# EAGLE design Videre (EAGLE 6.4)

## Sheet 1 of 4
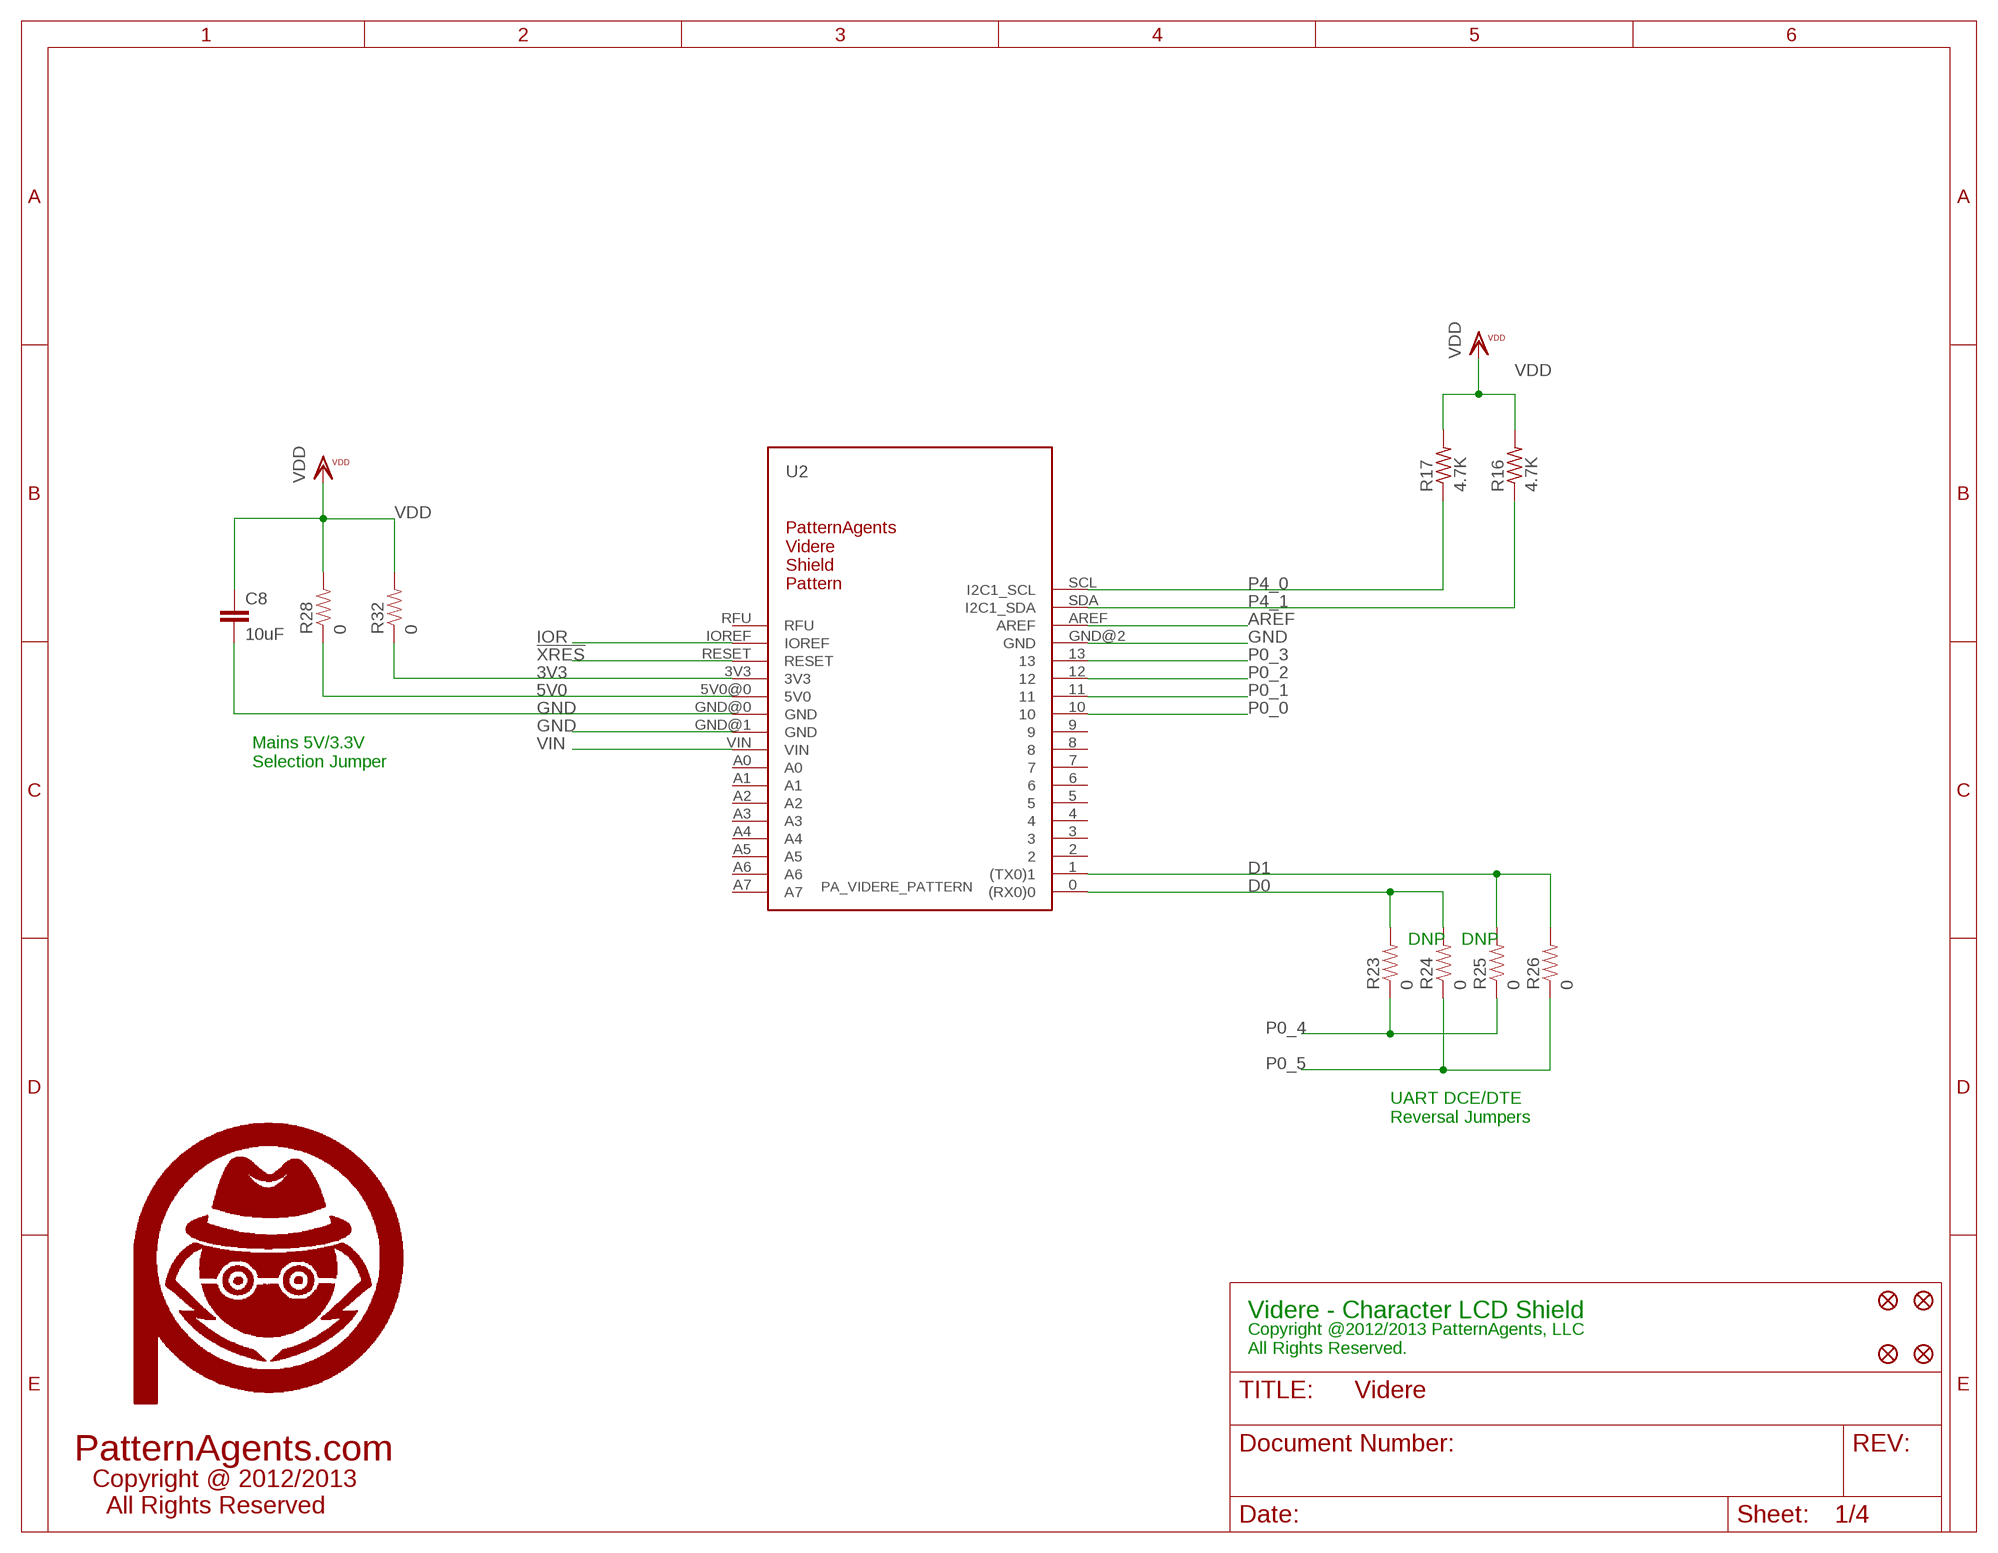
[diagram p0: schematic, sheet 1]

### Parts
C8  10uF  CAP1210  [1210]
FID1  FIDUCIAL1.5X3  [FIDUCIAL-1.5X3]
FID2  FIDUCIAL1.5X3  [FIDUCIAL-1.5X3]
FID3  FIDUCIAL1.5X3  [FIDUCIAL-1.5X3]
FID4  FIDUCIAL1.5X3  [FIDUCIAL-1.5X3]
R16  4.7K  RESISTORR0603  [R0603]
R17  4.7K  RESISTORR0603  [R0603]
R23  0  RESISTOR_SFE0603-RES  [0603-RES]
R24  0  RESISTOR_SFE0603-RES  [0603-RES]
R25  0  RESISTOR_SFE0603-RES  [0603-RES]
R26  0  RESISTOR_SFE0603-RES  [0603-RES]
R28  0  RESISTOR_SFE0603-RES  [0603-RES@1]
R32  0  RESISTOR_SFE0603-RES  [0603-RES@1]
U2  PA_VIDERE_PATTERN  [PA_VIDERE_PATTERN]
U$3  PA_LOGO_SYMLARGE  [PA_LOGO_AGENT_LRG_SYM]

### Nets
3V3: R32.1 U2.3V3
5V0: R28.1 U2.5V0@0(5V0)
!XRES: U2.RESET ; also sheet 2
AREF: U2.AREF
D0: R23.2 R24.2 U2.0((RX0)0)
D1: R25.2 R26.2 U2.1((TX0)1)
GND: C8.2 U2.GND@0(GND) U2.GND@1(GND) U2.GND@2(GND) ; also sheet 2,3,4
IOR: U2.IOREF
P0_0: U2.10 ; also sheet 2
P0_1: U2.11 ; also sheet 2
P0_2: U2.12 ; also sheet 2
P0_3: U2.13 ; also sheet 2
P0_4: R23.1 R25.1 ; also sheet 2
P0_5: R24.1 R26.1 ; also sheet 2
P4_0: R17.1 U2.SCL(I2C1_SCL) ; also sheet 2
P4_1: R16.1 U2.SDA(I2C1_SDA) ; also sheet 2
VDD: C8.1 R16.2 R17.2 R28.2 R32.2 ; also sheet 2,3,4
VIN: U2.VIN ; also sheet 4
Unconnected: U2.2 U2.3 U2.4 U2.5 U2.6 U2.7 U2.8 U2.9 U2.A0 U2.A1 U2.A2 U2.A3 U2.A4 U2.A5 U2.A6 U2.A7

### Notes on the sheet
- Mains 5V/3.3V
  Selection Jumper
- DNP | DNP
- UART DCE/DTE
  Reversal Jumpers
- Videre - Character LCD Shield
- Copyright @2012/2013 PatternAgents, LLC
  All Rights Reserved.
- PatternAgents.com
- Copyright @ 2012/2013
    All Rights Reserved

## Sheet 2 of 4
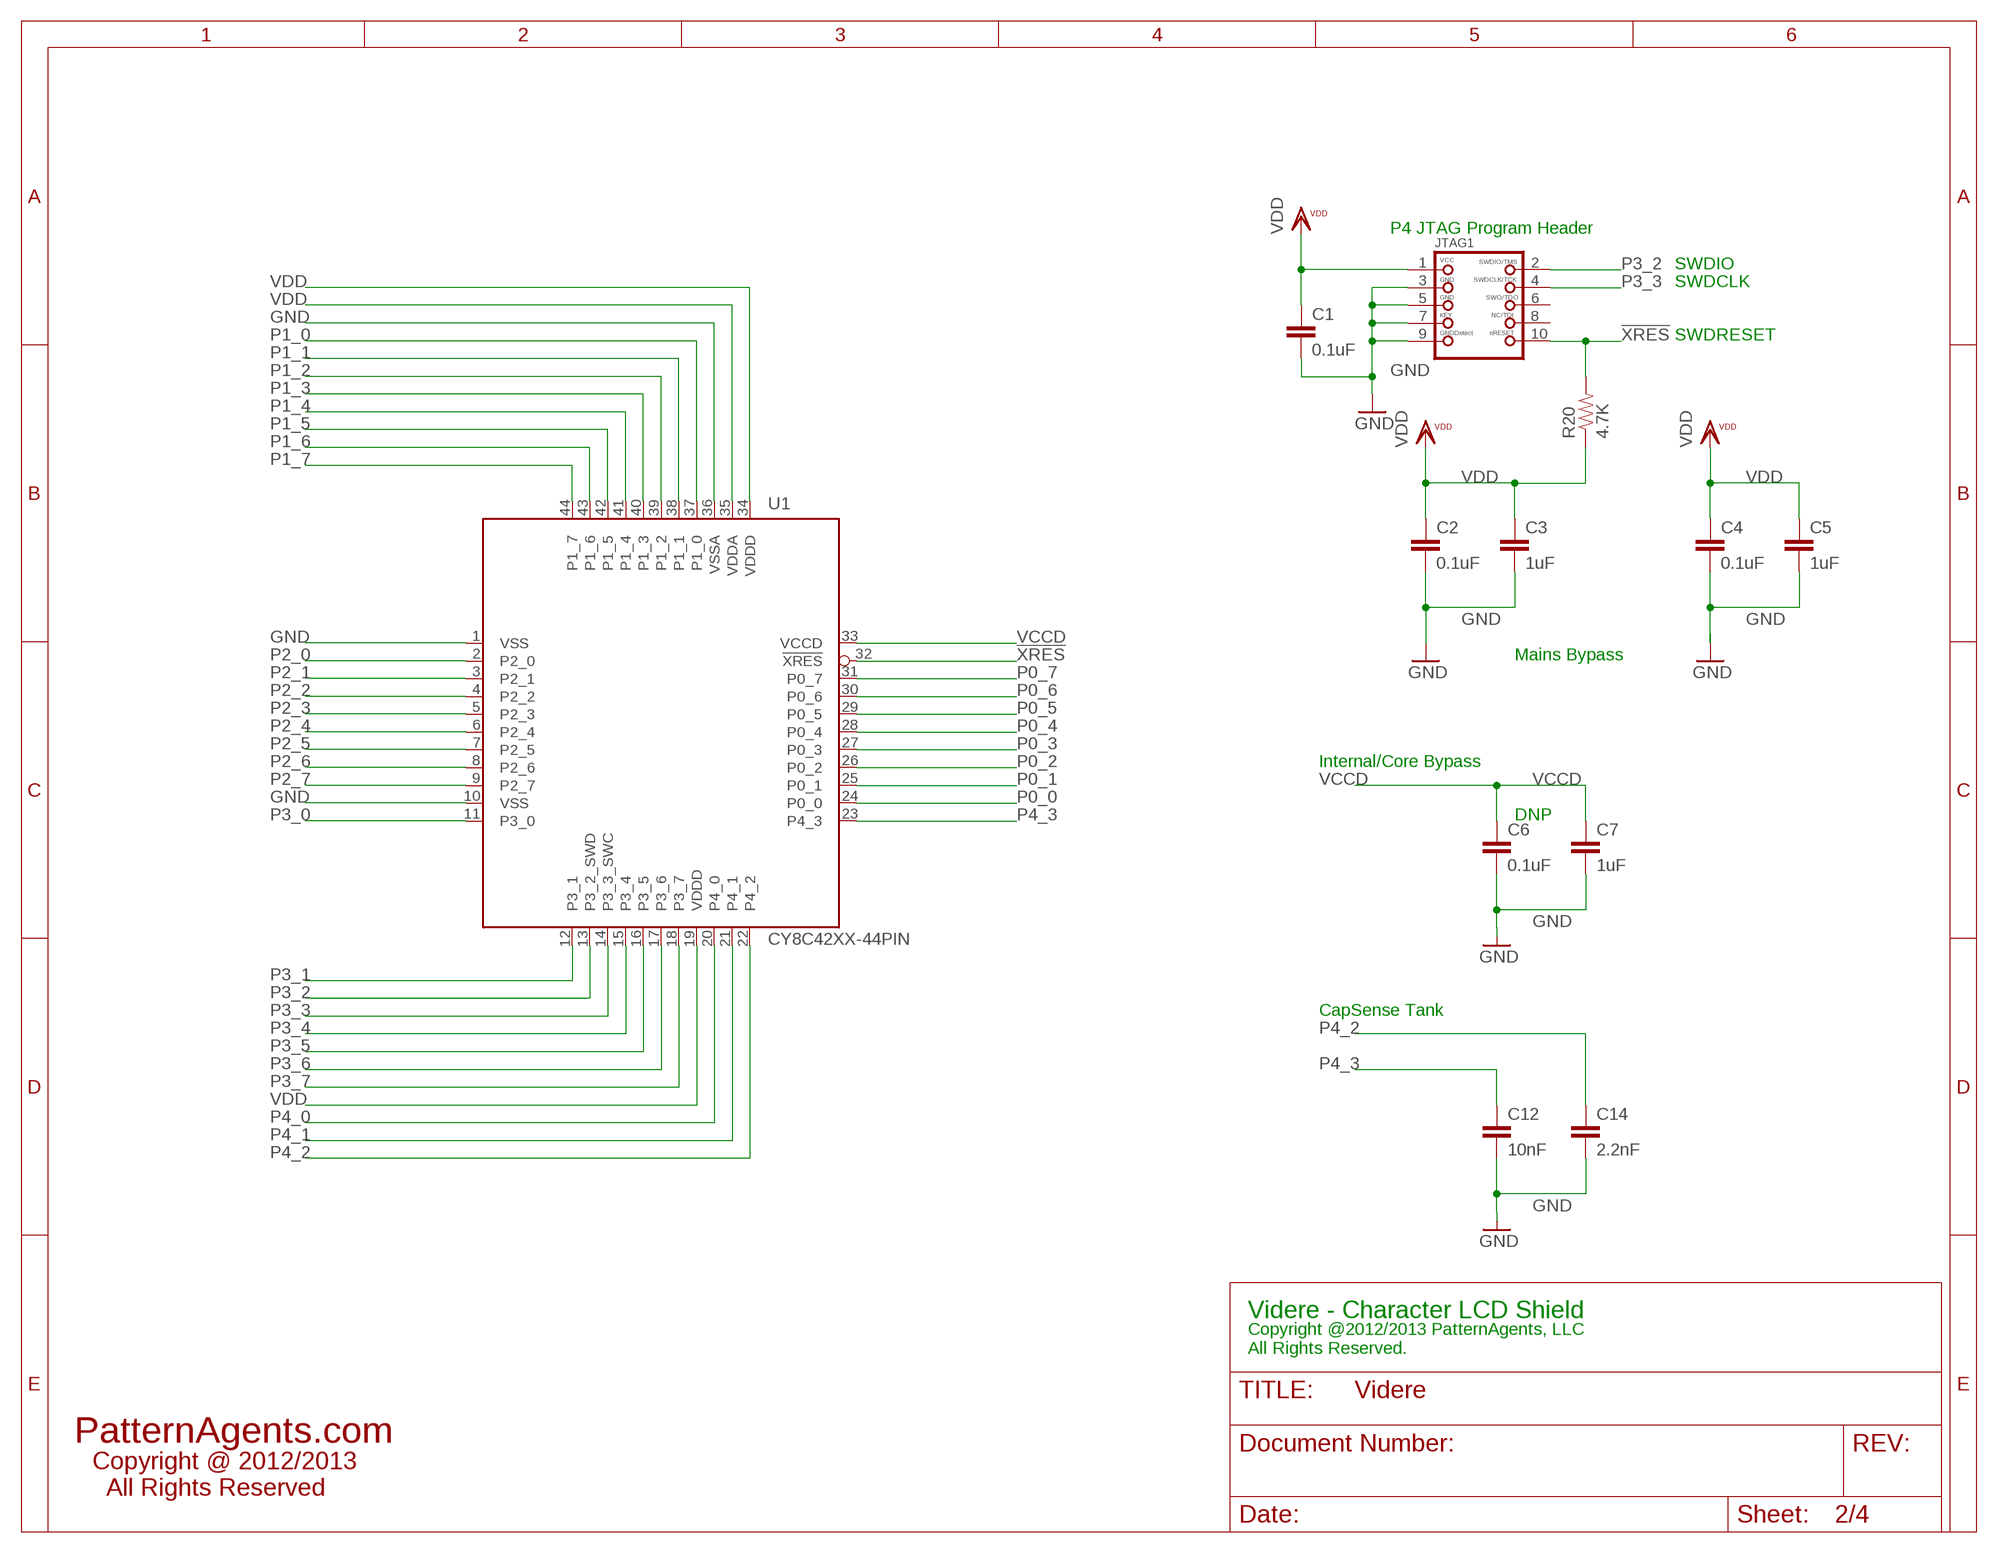
[diagram p1: schematic, sheet 2]

### Parts
C1  0.1uF  CAP0603-CAP  [0603-CAP]
C2  0.1uF  CAP0603-CAP  [0603-CAP]
C3  1uF  CAP0603-CAP  [0603-CAP]
C4  0.1uF  CAP0603-CAP  [0603-CAP]
C5  1uF  CAP0603-CAP  [0603-CAP]
C6  0.1uF  CAP0603-CAP  [0603-CAP]
C7  1uF  CAP0603-CAP  [0603-CAP]
C12  10nF  CAP0603-CAP  [0603-CAP]
C14  2.2nF  CAP0603-CAP  [0603-CAP]
JTAG1  JTAG-CORTEXM3  [2X05_1.27MM_SMT]
R20  4.7K  RESISTOR_SFE0603-RES  [0603-RES]
U1  CY8C42XX-44PIN  [TQFP-10X10-44]

### Nets
!XRES: JTAG1.10 R20.2 U1.32(!XRES) ; also sheet 1
GND: C1.2 C2.2 C3.2 C4.2 C5.2 C6.2 C7.2 C12.2 C14.2 JTAG1.3 JTAG1.5 JTAG1.7 JTAG1.9 U1.1(VSS) U1.10(VSS) U1.36(VSSA) ; also sheet 1,3,4
P0_0: U1.24(P0_0) ; also sheet 1
P0_1: U1.25(P0_1) ; also sheet 1
P0_2: U1.26(P0_2) ; also sheet 1
P0_3: U1.27(P0_3) ; also sheet 1
P0_4: U1.28(P0_4) ; also sheet 1
P0_5: U1.29(P0_5) ; also sheet 1
P0_6: U1.30(P0_6) ; also sheet 3
P0_7: U1.31(P0_7) ; also sheet 3
P1_0: U1.37(P1_0) ; also sheet 3
P1_1: U1.38(P1_1) ; also sheet 3
P1_2: U1.39(P1_2) ; also sheet 3
P1_3: U1.40(P1_3) ; also sheet 3
P1_4: U1.41(P1_4) ; also sheet 3
P1_5: U1.42(P1_5) ; also sheet 3
P1_6: U1.43(P1_6) ; also sheet 3
P1_7: U1.44(P1_7) ; also sheet 3
P2_0: U1.2(P2_0) ; also sheet 4
P2_1: U1.3(P2_1) ; also sheet 4
P2_2: U1.4(P2_2) ; also sheet 4
P2_3: U1.5(P2_3) ; also sheet 4
P2_4: U1.6(P2_4) ; also sheet 4
P2_5: U1.7(P2_5) ; also sheet 4
P2_6: U1.8(P2_6) ; also sheet 4
P2_7: U1.9(P2_7) ; also sheet 4
P3_0: U1.11(P3_0) ; also sheet 4
P3_1: U1.12(P3_1) ; also sheet 4
P3_2: JTAG1.2 U1.13(P3_2_SWD)
P3_3: JTAG1.4 U1.14(P3_3_SWC)
P3_4: U1.15(P3_4) ; also sheet 4
P3_5: U1.16(P3_5) ; also sheet 4
P3_6: U1.17(P3_6) ; also sheet 4
P3_7: U1.18(P3_7) ; also sheet 4
P4_0: U1.20(P4_0) ; also sheet 1
P4_1: U1.21(P4_1) ; also sheet 1
P4_2: C14.1 U1.22(P4_2)
P4_3: C12.1 U1.23(P4_3)
VCCD: C6.1 C7.1 U1.33(VCCD)
VDD: C1.1 C2.1 C3.1 C4.1 C5.1 JTAG1.1 R20.1 U1.19(VDDD) U1.34(VDDD) U1.35(VDDA) ; also sheet 1,3,4
Unconnected: JTAG1.6 JTAG1.8

### Notes on the sheet
- P4 JTAG Program Header
- SWDIO
- SWDCLK
- SWDRESET
- Mains Bypass
- Internal/Core Bypass
- DNP
- CapSense Tank
- Videre - Character LCD Shield
- Copyright @2012/2013 PatternAgents, LLC
  All Rights Reserved.
- PatternAgents.com
- Copyright @ 2012/2013
    All Rights Reserved

## Sheet 3 of 4
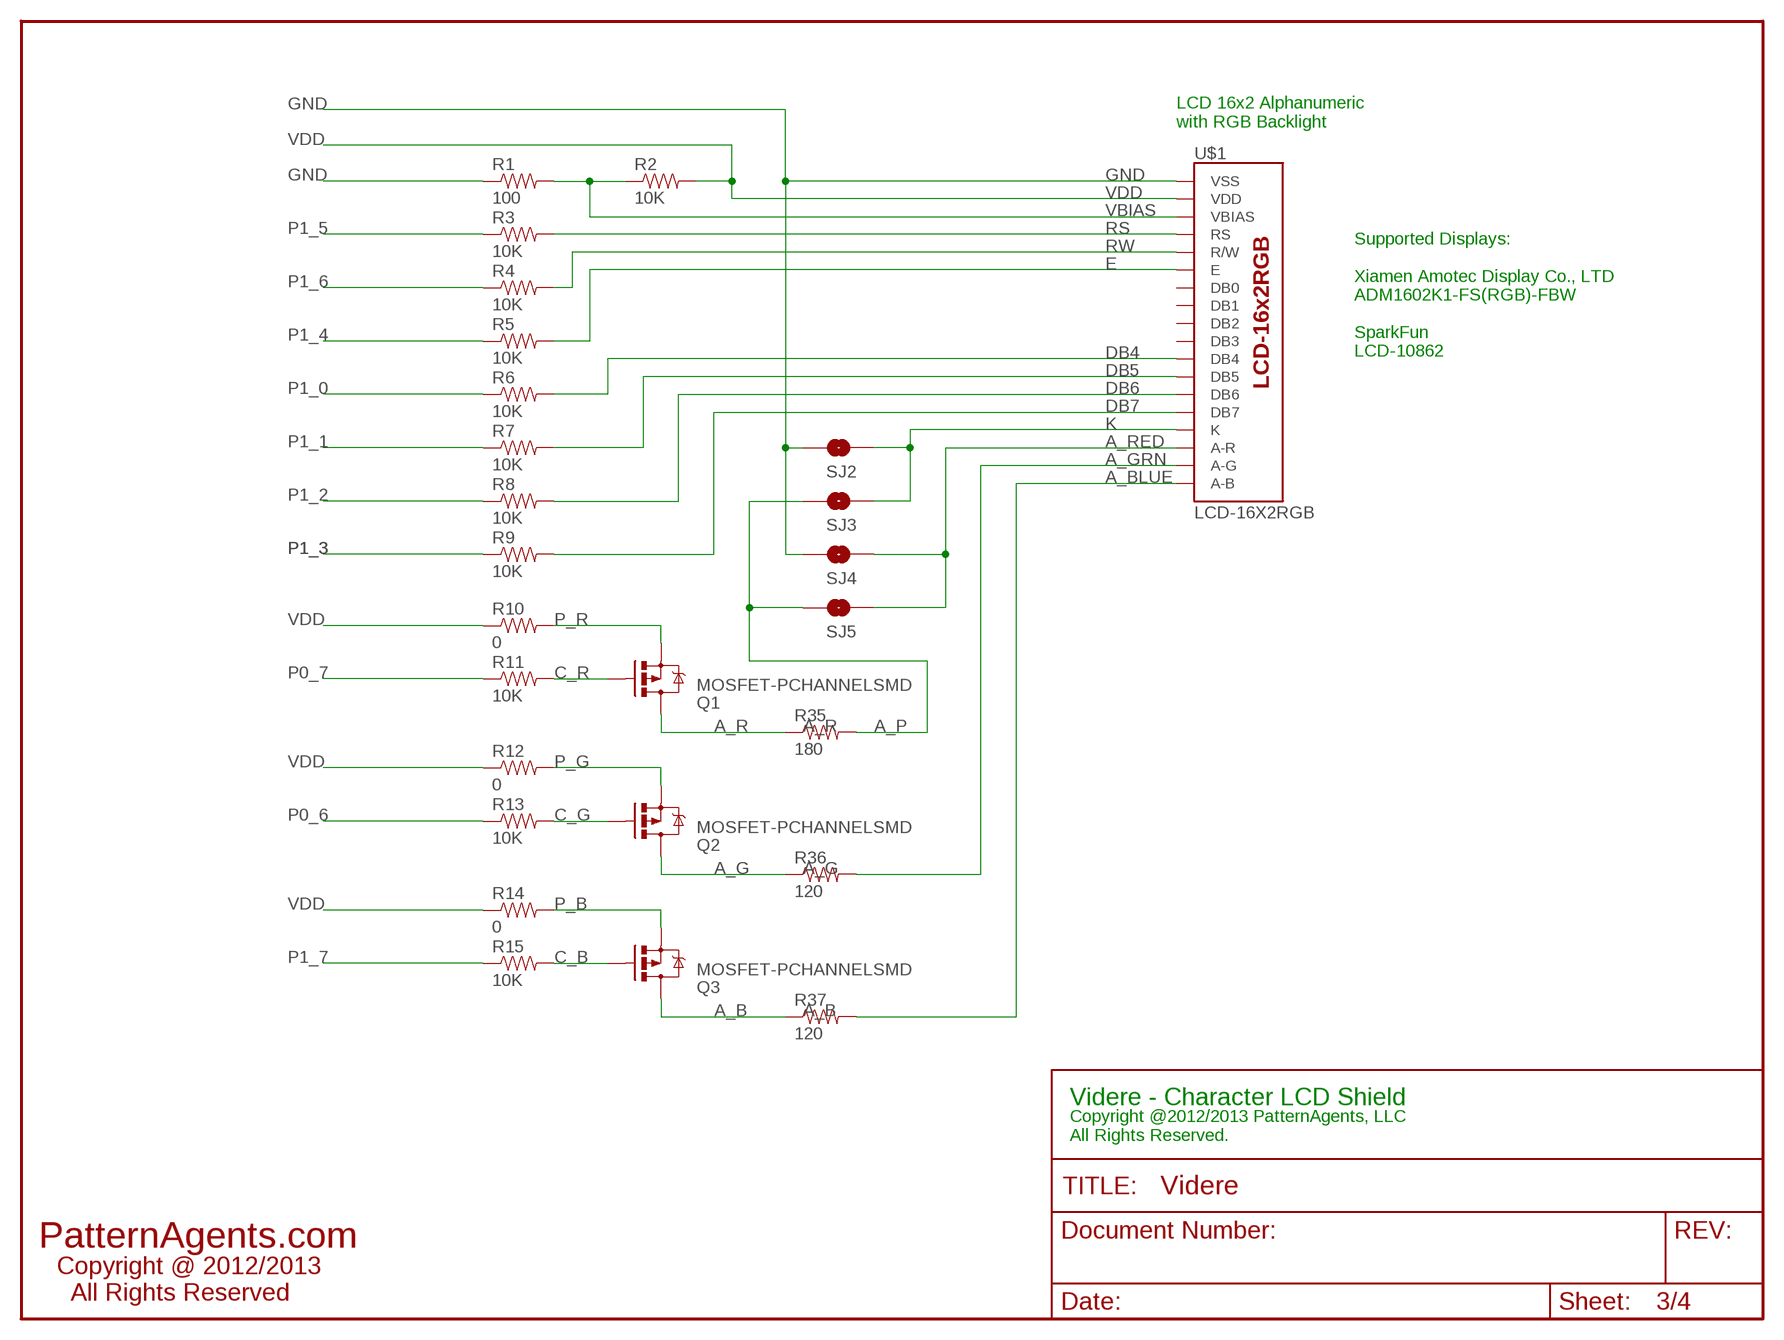
[diagram p2: schematic, sheet 3]

### Parts
Q1  MOSFET-PCHANNELSMD  [SOT23-3]
Q2  MOSFET-PCHANNELSMD  [SOT23-3]
Q3  MOSFET-PCHANNELSMD  [SOT23-3]
R1  100  RESISTOR_SFE0603-RES  [0603-RES]
R2  10K  RESISTOR_SFE0603-RES  [0603-RES]
R3  10K  RESISTOR_SFE0603-RES  [0603-RES]
R4  10K  RESISTOR_SFE0603-RES  [0603-RES]
R5  10K  RESISTOR_SFE0603-RES  [0603-RES]
R6  10K  RESISTOR_SFE0603-RES  [0603-RES]
R7  10K  RESISTOR_SFE0603-RES  [0603-RES]
R8  10K  RESISTOR_SFE0603-RES  [0603-RES]
R9  10K  RESISTOR_SFE0603-RES  [0603-RES]
R10  0  RESISTOR_SFE0603-RES  [0603-RES]
R11  10K  RESISTOR_SFE0603-RES  [0603-RES]
R12  0  RESISTOR_SFE0603-RES  [0603-RES]
R13  10K  RESISTOR_SFE0603-RES  [0603-RES]
R14  0  RESISTOR_SFE0603-RES  [0603-RES]
R15  10K  RESISTOR_SFE0603-RES  [0603-RES]
R35  180  RESISTOR_SFE0603-RES  [0603-RES]
R36  120  RESISTOR_SFE0603-RES  [0603-RES]
R37  120  RESISTOR_SFE0603-RES  [0603-RES]
SJ2  SOLDERJUMPERNO  [SJ_2S-NO]
SJ3  SOLDERJUMPERNO  [SJ_2S-NO]
SJ4  SOLDERJUMPERNO  [SJ_2S-NO]
SJ5  SOLDERJUMPERNO  [SJ_2S-NO]
U$1  LCD-16X2RGB  [LCD-16X2RGB]

### Nets
A_B: Q3.3(D) R37.1
A_BLUE: R37.2 U$1.18(A-B)
A_G: Q2.3(D) R36.1
A_GRN: R36.2 U$1.17(A-G)
A_P: R35.2 SJ3.2 SJ5.2
A_R: Q1.3(D) R35.1
A_RED: SJ4.1 SJ5.1 U$1.16(A-R)
C_B: Q3.1(G) R15.2
C_G: Q2.1(G) R13.2
C_R: Q1.1(G) R11.2
DB4: R6.2 U$1.11(DB4)
DB5: R7.2 U$1.12(DB5)
DB6: R8.2 U$1.13(DB6)
DB7: R9.2 U$1.14(DB7)
E: R5.2 U$1.6(E)
GND: R1.1 SJ2.2 SJ4.2 U$1.1(VSS) ; also sheet 1,2,4
K: SJ2.1 SJ3.1 U$1.15(K)
P0_6: R13.1 ; also sheet 2
P0_7: R11.1 ; also sheet 2
P1_0: R6.1 ; also sheet 2
P1_1: R7.1 ; also sheet 2
P1_2: R8.1 ; also sheet 2
P1_3: R9.1 ; also sheet 2
P1_4: R5.1 ; also sheet 2
P1_5: R3.1 ; also sheet 2
P1_6: R4.1 ; also sheet 2
P1_7: R15.1 ; also sheet 2
P_B: Q3.2(S) R14.2
P_G: Q2.2(S) R12.2
P_R: Q1.2(S) R10.2
RS: R3.2 U$1.4(RS)
RW: R4.2 U$1.5(R/W)
VBIAS: R1.2 R2.1 U$1.3(VBIAS)
VDD: R2.2 R10.1 R12.1 R14.1 U$1.2(VDD) ; also sheet 1,2,4
Unconnected: U$1.7(DB0) U$1.8(DB1) U$1.9(DB2) U$1.10(DB3)

### Notes on the sheet
- LCD 16x2 Alphanumeric
  with RGB Backlight
- Supported Displays:
  
  Xiamen Amotec Display Co., LTD
  ADM1602K1-FS(RGB)-FBW
  
  SparkFun
  LCD-10862
- Videre - Character LCD Shield
- Copyright @2012/2013 PatternAgents, LLC
  All Rights Reserved.
- PatternAgents.com
- Copyright @ 2012/2013
    All Rights Reserved

## Sheet 4 of 4
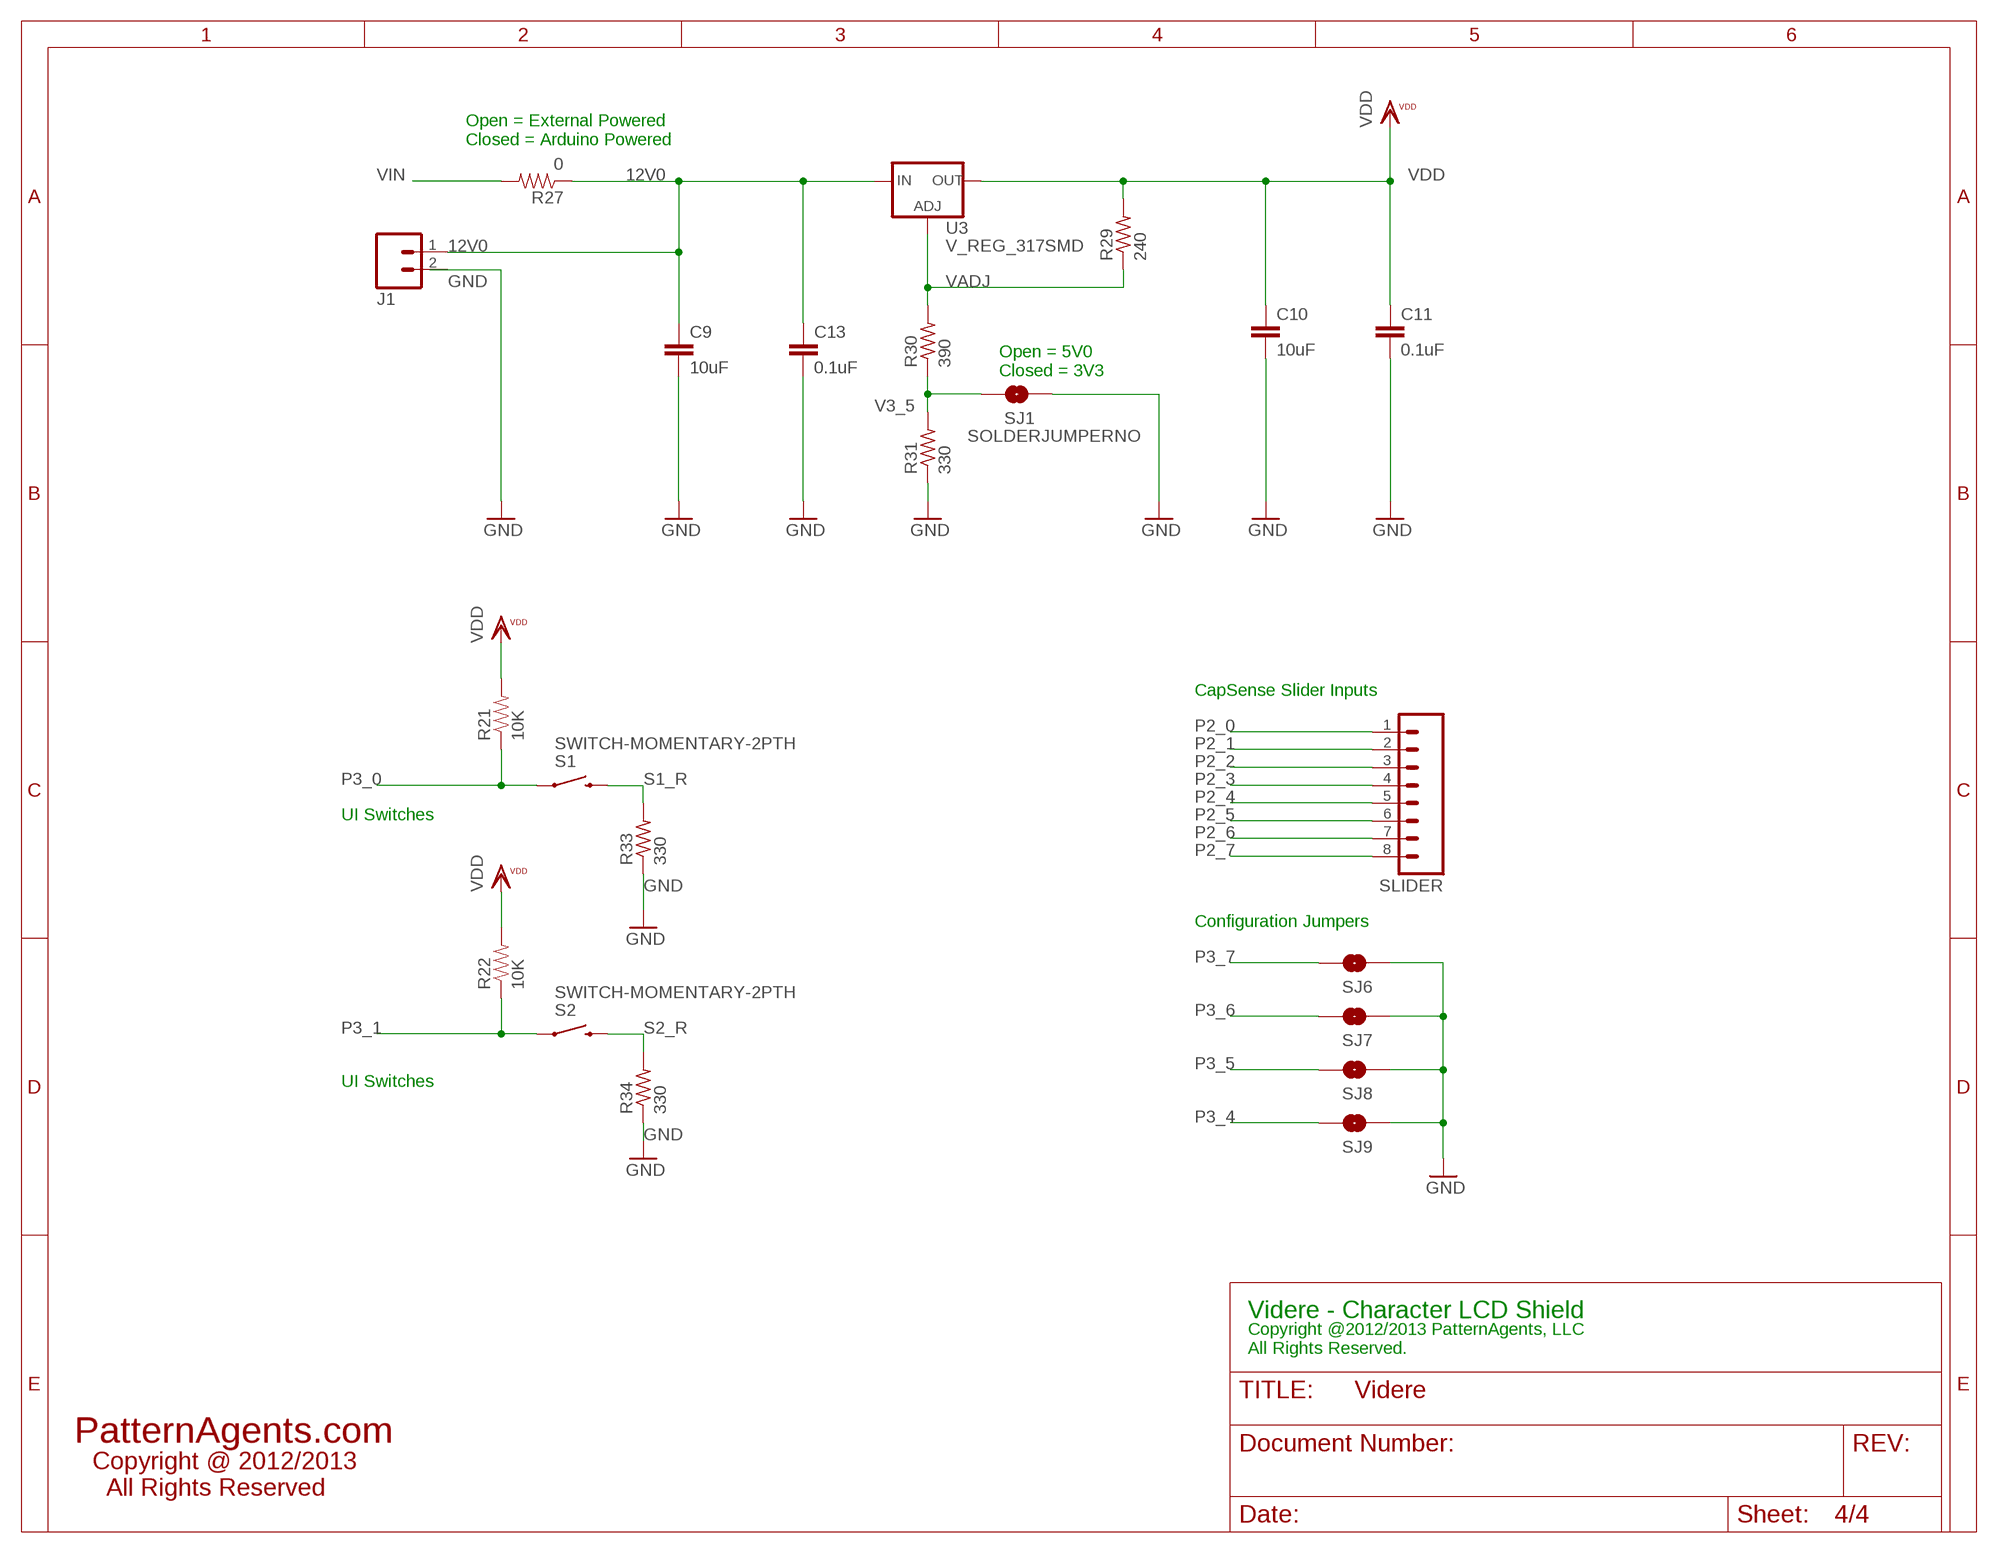
[diagram p3: schematic, sheet 4]

### Parts
C9  10uF  CAP1210  [1210]
C10  10uF  CAP1210  [1210]
C11  0.1uF  CAP0603-CAP  [0603-CAP]
C13  0.1uF  CAP0603-CAP  [0603-CAP]
J1  M02PTH  [1X02]
R21  10K  RESISTOR_SFE0603-RES  [0603-RES]
R22  10K  RESISTOR_SFE0603-RES  [0603-RES]
R27  0  RESISTOR_SFE0603-RES  [0603-RES]
R29  240  RESISTORR0603  [R0603]
R30  390  RESISTORR0603  [R0603]
R31  330  RESISTORR0603  [R0603]
R33  330  RESISTORR0603  [R0603]
R34  330  RESISTORR0603  [R0603]
S1  SWITCH-MOMENTARY-2PTH  [TACTILE-PTH]
S2  SWITCH-MOMENTARY-2PTH  [TACTILE-PTH]
SJ1  SOLDERJUMPERNO  [SJ_2S-NO]
SJ6  SOLDERJUMPERNO  [SJ_2S-NO]
SJ7  SOLDERJUMPERNO  [SJ_2S-NO]
SJ8  SOLDERJUMPERNO  [SJ_2S-NO]
SJ9  SOLDERJUMPERNO  [SJ_2S-NO]
SLIDER  M081X08  [1X08]
U3  V_REG_317SMD  [SOT223]

### Nets
12V0: C9.1 C13.1 J1.1 R27.1 U3.3(IN)
GND: C9.2 C10.2 C11.2 C13.2 J1.2 R31.1 R33.1 R34.1 SJ1.1 SJ6.1 SJ7.1 SJ8.1 SJ9.1 ; also sheet 1,2,3
P2_0: SLIDER.1 ; also sheet 2
P2_1: SLIDER.2 ; also sheet 2
P2_2: SLIDER.3 ; also sheet 2
P2_3: SLIDER.4 ; also sheet 2
P2_4: SLIDER.5 ; also sheet 2
P2_5: SLIDER.6 ; also sheet 2
P2_6: SLIDER.7 ; also sheet 2
P2_7: SLIDER.8 ; also sheet 2
P3_0: R21.1 S1.1 ; also sheet 2
P3_1: R22.1 S2.1 ; also sheet 2
P3_4: SJ9.2 ; also sheet 2
P3_5: SJ8.2 ; also sheet 2
P3_6: SJ7.2 ; also sheet 2
P3_7: SJ6.2 ; also sheet 2
S1_R: R33.2 S1.3
S2_R: R34.2 S2.3
V3_5: R30.1 R31.2 SJ1.2
VADJ: R29.1 R30.2 U3.1(ADJ)
VDD: C10.1 C11.1 R21.2 R22.2 R29.2 U3.2(OUT) ; also sheet 1,2,3
VIN: R27.2 ; also sheet 1

### Notes on the sheet
- Open = External Powered
  Closed = Arduino Powered
- Open = 5V0
  Closed = 3V3
- CapSense Slider Inputs
- UI Switches
- Configuration Jumpers
- UI Switches
- Videre - Character LCD Shield
- Copyright @2012/2013 PatternAgents, LLC
  All Rights Reserved.
- PatternAgents.com
- Copyright @ 2012/2013
    All Rights Reserved

## Power pins joined to a net without a drawn wire
RFU: U2.RFU

## Library data of the parts
C1-C14 = PatternAgents-Misc:CAP: Capacitor Standard 0603 ceramic capacitor, and 0.1" leaded capacitor.
FID1-FID4 = PatternAgents-Misc:FIDUCIAL: Fiducial Alignment Points Various fiducial points for machine vision alignment.
J1 = SparkFun-Connectors:M02: Header 2 Standard 2-pin 0.1" header. Use with straight break away headers (SKU : PRT-00116), right angle break away headers (PRT-00553), swiss pins (PRT-00743), machine pins (PRT-00117), and female headers (PRT-00115). Molex polarized connector foot print use with SKU : PRT-08233 with associated crimp pins and housings.
JTAG1 = PatternAgents-Cypress:JTAG-CORTEXM3: JTAG Programming Connector LBR Source: http://www.patternagents.com THIS SOFTWARE IS PROVIDED BY THE CONTRIBUTORS "AS IS" AND WITHOUT ANY EXPRESS OR IMPLIED WARRANTIES, INCLUDING, BUT NOT LIMITED TO, THE IMPLIED WARRANTIES OF MERCHANTABILITY AND FITNESS FOR A PARTICULAR PURPOSE ARE DISCLAIMED. IN NO EVENT SHALL THE COPYRIGHT OWNER OR CONTRIBUTORS BE LIABLE FOR ANY DIRECT, INDIRECT, INCIDENTAL, SPECIAL, EXEMPLARY, OR CONSEQUENTIAL DAMAGES (INCLUDING, BUT NOT LIMITED TO, PROCUREMENT OF SUBSTITUTE GOODS OR SERVICES; LOSS OF USE, DATA, OR PROFITS; OR BUSINESS INTERRUPTION) HOWEVER CAUSED AND ON ANY THEORY OF LIABILITY, WHETHER IN CONTRACT, STRICT LIABILITY, OR TORT (INCLUDING NEGLIGENCE OR OTHERWISE) ARISING IN ANY WAY OUT OF THE USE OF THIS SOFTWARE, EVEN IF ADVISED OF THE POSSIBILITY OF SUCH DAMAGE.
Q1-Q3 = SparkFun-DiscreteSemi:MOSFET-PCHANNEL: Generic PMOSFET
R1-R15 R20-R27 R35-R37 = PatternAgents-Misc:RESISTOR_SFE: Resistor Basic schematic elements and footprints for 0603, 1206, and PTH resistors.
R16 R17 R29-R31 R33 R34 = PatternAgents-Misc:RESISTOR: RESISTOR, American symbol
R28 R32 = moxdes_std:RESISTOR_SFE: Resistor Basic schematic elements and footprints for 0603, 1206, and PTH resistors.
S1 S2 = SparkFun-Electromechanical:SWITCH-MOMENTARY-2: Various NO switches- pushbuttons, reed, etc
SJ1-SJ9 = SparkFun-Passives:SOLDERJUMPER: Solder Jumper Standard SMD solder jumper. Used to automate production. Two varients : Normally Open and Normally Closed are the same, but have different paste layers. NC will have a large amount of paste and should jumper during reflow.
SLIDER = PatternAgents-Misc:M08: Header 8 Standard 8-pin 0.1" header. Use with straight break away headers (SKU : PRT-00116), right angle break away headers (PRT-00553), swiss pins (PRT-00743), machine pins (PRT-00117), and female headers (PRT-00115).
U1 = PatternAgents-Cypress:CY8C42XX-44PIN: Cypress PSoC® 4 - Programmable System on Chip, Cortex-M0 Based http://www.cypress.com/?mpn=CY8C4245AXI-483 LBR Source: http://www.patternagents.com THIS SOFTWARE IS PROVIDED BY THE CONTRIBUTORS "AS IS" AND WITHOUT ANY EXPRESS OR IMPLIED WARRANTIES, INCLUDING, BUT NOT LIMITED TO, THE IMPLIED WARRANTIES OF MERCHANTABILITY AND FITNESS FOR A PARTICULAR PURPOSE ARE DISCLAIMED. IN NO EVENT SHALL THE COPYRIGHT OWNER OR CONTRIBUTORS BE LIABLE FOR ANY DIRECT, INDIRECT, INCIDENTAL, SPECIAL, EXEMPLARY, OR CONSEQUENTIAL DAMAGES (INCLUDING, BUT NOT LIMITED TO, PROCUREMENT OF SUBSTITUTE GOODS OR SERVICES; LOSS OF USE, DATA, OR PROFITS; OR BUSINESS INTERRUPTION) HOWEVER CAUSED AND ON ANY THEORY OF LIABILITY, WHETHER IN CONTRACT, STRICT LIABILITY, OR TORT (INCLUDING NEGLIGENCE OR OTHERWISE) ARISING IN ANY WAY OUT OF THE USE OF THIS SOFTWARE, EVEN IF ADVISED OF THE POSSIBILITY OF SUCH DAMAGE.
U2 = PatternAgents-Boards:PA_VIDERE_PATTERN: PatternAgents Videre Shield Pattern Source LBR : http://www.patternagents.com Github : https://github.com/patternagents License : http://creativecommons.org/licenses/by-sa/2.5/ (Creative Commons 2.5) THIS SOFTWARE IS PROVIDED BY THE CONTRIBUTORS "AS IS" AND WITHOUT ANY EXPRESS OR IMPLIED WARRANTIES, INCLUDING, BUT NOT LIMITED TO, THE IMPLIED WARRANTIES OF MERCHANTABILITY AND FITNESS FOR A PARTICULAR PURPOSE ARE DISCLAIMED. IN NO EVENT SHALL THE COPYRIGHT OWNER OR CONTRIBUTORS BE LIABLE FOR ANY DIRECT, INDIRECT, INCIDENTAL, SPECIAL, EXEMPLARY, OR CONSEQUENTIAL DAMAGES (INCLUDING, BUT NOT LIMITED TO, PROCUREMENT OF SUBSTITUTE GOODS OR SERVICES; LOSS OF USE, DATA, OR PROFITS; OR BUSINESS INTERRUPTION) HOWEVER CAUSED AND ON ANY THEORY OF LIABILITY, WHETHER IN CONTRACT, STRICT LIABILITY, OR TORT (INCLUDING NEGLIGENCE OR OTHERWISE) ARISING IN ANY WAY OUT OF THE USE OF THIS SOFTWARE, EVEN IF ADVISED OF THE POSSIBILITY OF SUCH DAMAGE.
U3 = SparkFun-PowerIC:V_REG_317: Voltage Regulator Standard LM317 adjustable voltage regulator. AOI (Adjust Output Input). Google 'LM317 Calculator' for easy to use app to get the two resistor values needed. 240/720 for 5V output. 240/390 for 3.3V output. Spark Fun Electronics SKU : COM-00527
U$1 = PatternAgents-Displays:LCD-16X2RGB
U$3 = PatternAgents-Logos:PA_LOGO_SYM: PatternAgents Logo Symbol Trademark : PatternAgents, LLC Github : https://github.com/PatternAgents/PCB_Libraries License : http://creativecommons.org/licenses/by-sa/3.0/ (Creative Commons 3.0) THIS SOFTWARE IS PROVIDED BY THE CONTRIBUTORS "AS IS" AND WITHOUT ANY EXPRESS OR IMPLIED WARRANTIES, INCLUDING, BUT NOT LIMITED TO, THE IMPLIED WARRANTIES OF MERCHANTABILITY AND FITNESS FOR A PARTICULAR PURPOSE ARE DISCLAIMED. IN NO EVENT SHALL THE COPYRIGHT OWNER OR CONTRIBUTORS BE LIABLE FOR ANY DIRECT, INDIRECT, INCIDENTAL, SPECIAL, EXEMPLARY, OR CONSEQUENTIAL DAMAGES (INCLUDING, BUT NOT LIMITED TO, PROCUREMENT OF SUBSTITUTE GOODS OR SERVICES; LOSS OF USE, DATA, OR PROFITS; OR BUSINESS INTERRUPTION) HOWEVER CAUSED AND ON ANY THEORY OF LIABILITY, WHETHER IN CONTRACT, STRICT LIABILITY, OR TORT (INCLUDING NEGLIGENCE OR OTHERWISE) ARISING IN ANY WAY OUT OF THE USE OF THIS SOFTWARE, EVEN IF ADVISED OF THE POSSIBILITY OF SUCH DAMAGE.

## Board
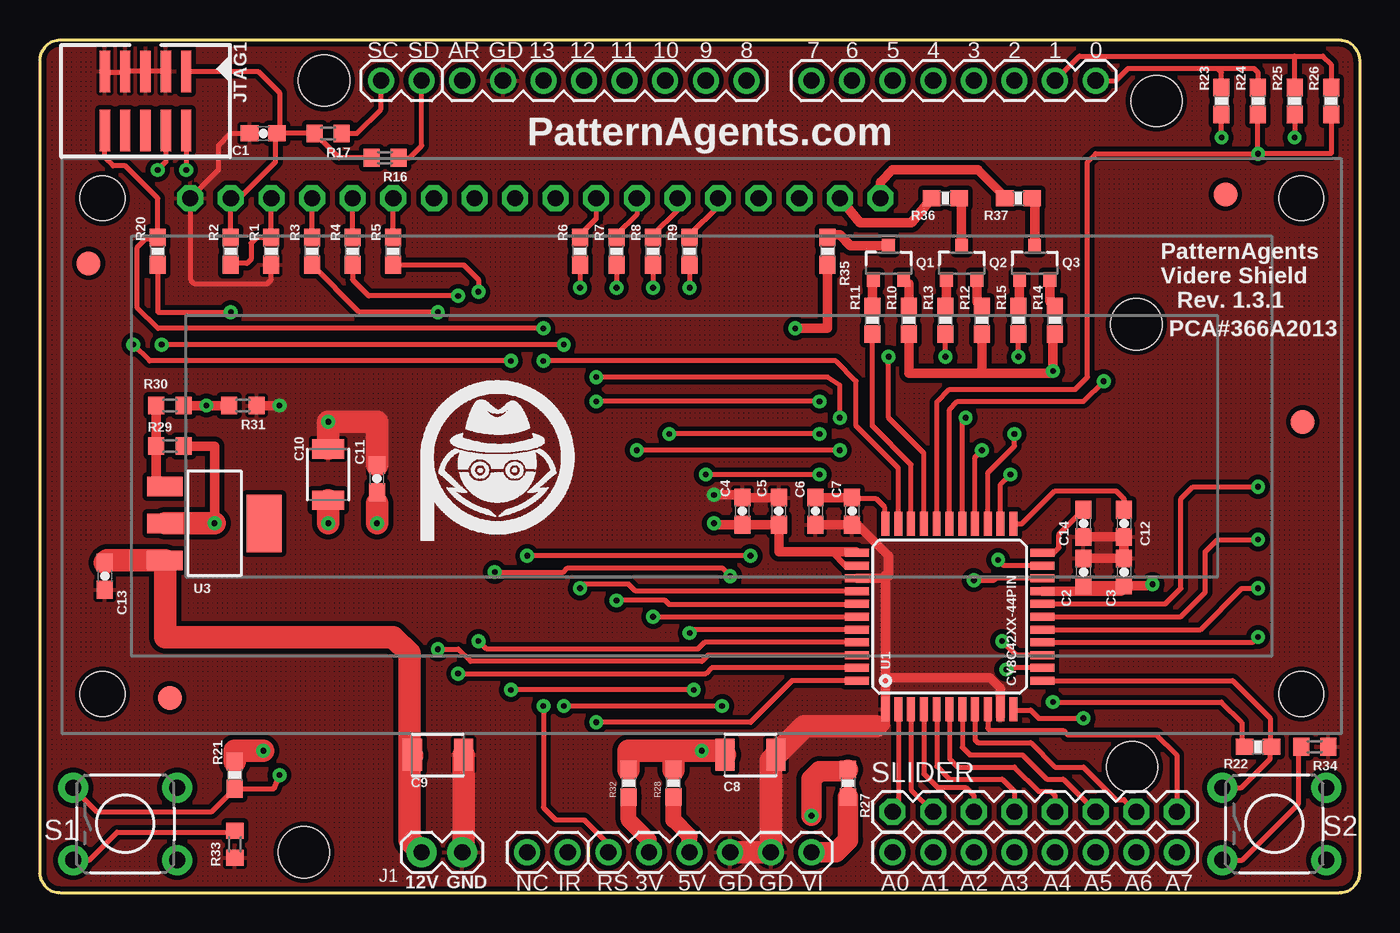
[diagram p4: board, top side]
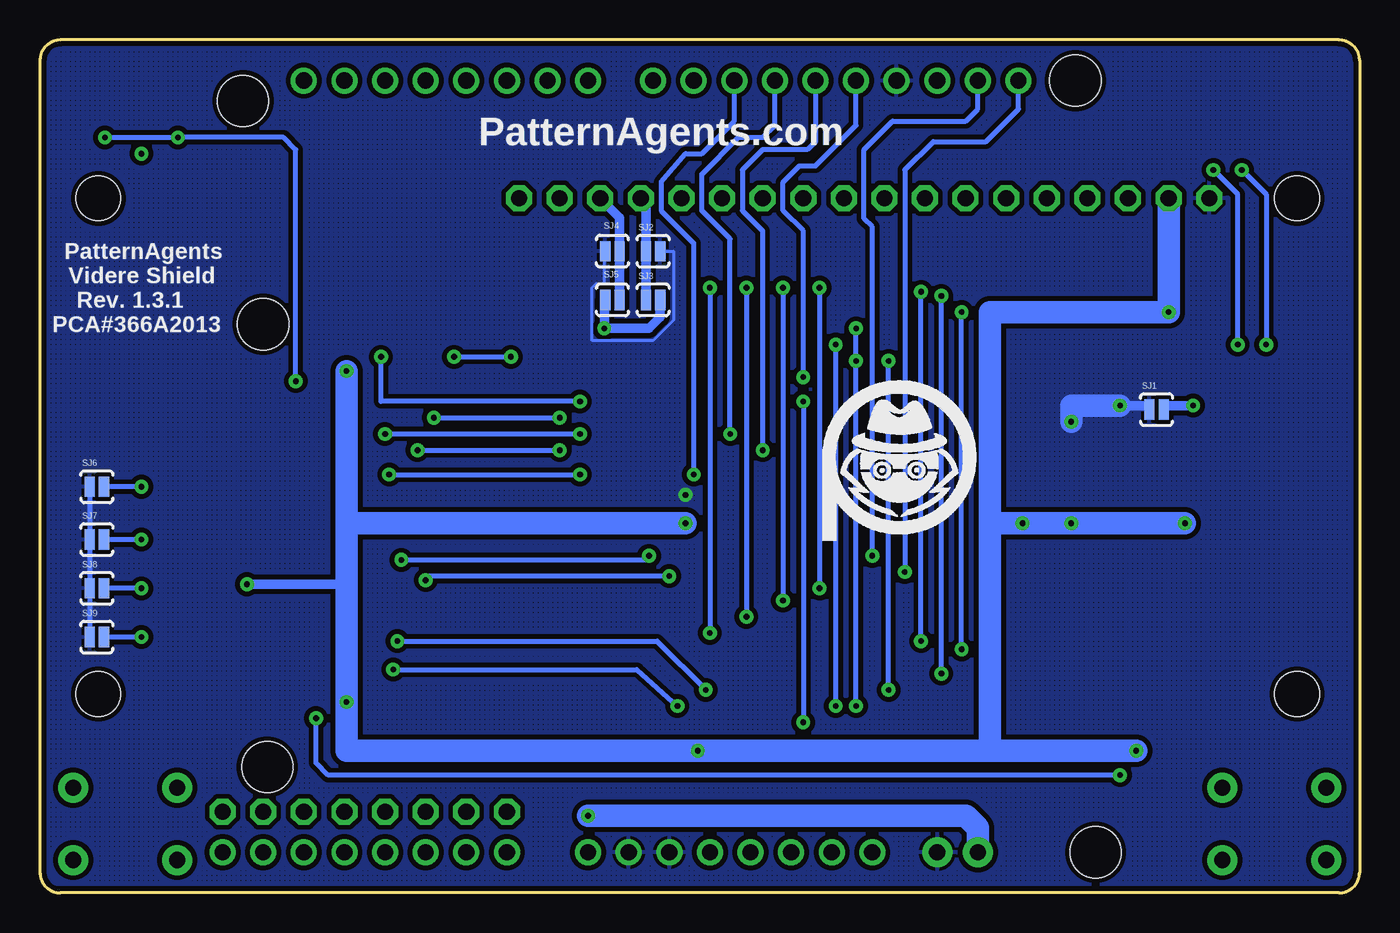
[diagram p5: board, bottom side, seen from below]

Size 82.55 x 53.34 mm. Coordinates in mm from the lower left corner, seen from the top.
Copper layers (1*16): Top 0.035mm / dielectric 1.5mm / Bottom 0.035mm
Design rules "PatternAgents": minimum track width 8mil, minimum drill 14mil, track to track 8mil, track to pad 8mil, pad to pad 8mil, via to via 8mil, smd to smd 8mil, copper to edge 10mil, drill to drill 8mil, minimum pad ring 12mil, minimum via ring 10mil, stop-mask expansion 4mil, vias tented up to drill 25mil, thermal gap 8mil

### Footprints (pad centres in the part's own frame; a part is rotated, then mirrored left to right if it is on the bottom)
0603-CAP = smd 1.1 x 1: 1 -0.85,0; 2 0.85,0
1210 = smd 1.2 x 2: 1 -1.6,0; 2 1.6,0
FIDUCIAL-1.5X3 = smd 1.5 x 1.5: 1 0,0
1X02 = drill 1.016 pad 1.88: 1 0,0; 2 2.54,0
2X05_1.27MM_SMT = smd 0.65 x 2.6: 1 -2.54,-1.85; 2 -2.54,1.85; 3 -1.27,-1.85; 4 -1.27,1.85; 5 0,-1.85; 6 0,1.85; 7 1.27,-1.85; 8 1.27,1.85; 9 2.54,-1.85; 10 2.54,1.85
SOT23-3 = smd 0.8 x 0.9: 1 -0.95,-1; 2 0.95,-1; 3 0,1.1
0603-RES = smd 1.1 x 1: 1 -0.85,0; 2 0.85,0
R0603 = smd 1 x 1.1: 1 -0.85,0; 2 0.85,0
TACTILE-PTH = drill 1.016 pad 1.88: 1 -3.251,2.261; 2 3.251,2.261; 3 -3.251,-2.261; 4 3.251,-2.261
SJ_2S-NO = smd 0.635 x 1.27: 1 -0.45,0; 2 0.45,0
1X08 = drill 1.016 octagon: 1 0,0; 2 2.54,0; 3 5.08,0; 4 7.62,0; 5 10.16,0; 6 12.7,0; 7 15.24,0; 8 17.78,0
TQFP-10X10-44 = smd 1.5 x 0.5: 1 -5.8,4; 2 -5.8,3.2; 3 -5.8,2.4; 4 -5.8,1.6; 5 -5.8,0.8; 6 -5.8,0; 7 -5.8,-0.8; 8 -5.8,-1.6; 9 -5.8,-2.4; 10 -5.8,-3.2; 11 -5.8,-4; 23 5.8,-4; 24 5.8,-3.2; 25 5.8,-2.4; 26 5.8,-1.6; 27 5.8,-0.8; 28 5.8,0; 29 5.8,0.8; 30 5.8,1.6; 31 5.8,2.4; 32 5.8,3.2; 33 5.8,4 | smd 0.5 x 1.5: 12 -4,-5.8; 13 -3.2,-5.8; 14 -2.4,-5.8; 15 -1.6,-5.8; 16 -0.8,-5.8; 17 0,-5.8; 18 0.8,-5.8; 19 1.6,-5.8; 20 2.4,-5.8; 21 3.2,-5.8; 22 4,-5.8; 34 4,5.8; 35 3.2,5.8; 36 2.4,5.8; 37 1.6,5.8; 38 0.8,5.8; 39 0,5.8; 40 -0.8,5.8; 41 -1.6,5.8; 42 -2.4,5.8; 43 -3.2,5.8; 44 -4,5.8
PA_VIDERE_PATTERN = drill 1.016: 0 66.04,50.8; 1 63.5,50.8; 2 60.96,50.8; 3 58.42,50.8; 3V3 38.1,2.54; 4 55.88,50.8; 5 53.34,50.8; 5V0@0 40.64,2.54; 6 50.8,50.8; 7 48.26,50.8; 8 44.196,50.8; 9 41.656,50.8; 10 39.116,50.8; 11 36.576,50.8; 12 34.036,50.8; 13 31.496,50.8; A0 53.34,2.54; A1 55.88,2.54; A2 58.42,2.54; A3 60.96,2.54; A4 63.5,2.54; A5 66.04,2.54; A6 68.58,2.54; A7 71.12,2.54; AREF 26.416,50.8; GND@0 43.18,2.54; GND@1 45.72,2.54; GND@2 28.956,50.8; IOREF 33.02,2.54; RESET 35.56,2.54; RFU 30.48,2.54; SCL 21.336,50.8; SDA 23.876,50.8; VIN 48.26,2.54 | hole 3.2: 17.78,50.8; 16.51,2.54; 68.326,7.874; 68.58,35.56; 69.85,49.53
SOT223 = smd 1.219 x 2.235: 1 -2.311,-3.099; 2 0,-3.099; 3 2.311,-3.099 | smd 3.6 x 2.2: 4 0,3.099
LCD-16X2RGB = drill 1.016 octagon: 1 -32,15.5; 2 -29.46,15.5; 3 -26.92,15.5; 4 -24.38,15.5; 5 -21.84,15.5; 6 -19.3,15.5; 7 -16.76,15.5; 8 -14.22,15.5; 9 -11.68,15.5; 10 -9.14,15.5; 11 -6.6,15.5; 12 -4.06,15.5; 13 -1.52,15.5; 14 1.02,15.5; 15 3.56,15.5; 16 6.1,15.5; 17 8.64,15.5; 18 11.18,15.5 | hole 2.8: -37.5,15.5; -37.5,-15.5; 37.5,15.5; 37.5,-15.5

### Placement (x,y rotation side)
C1  13.97,47.5 180 top
C2  65.28,20.07 90 top
C3  67.82,20.07 90 top
C4  43.94,23.88 90 top
C5  46.23,23.88 90 top
C6  48.51,23.88 270 top
C7  50.8,23.88 270 top
C8  44.45,8.64 0 top
C9  24.89,8.64 0 top
C10  18.03,26.16 90 top
C11  21.08,25.91 90 top
C12  67.82,23.11 270 top
C13  4.06,19.81 270 top
C14  65.28,23.11 270 top
FID1  8.13,12.19 0 top
FID2  74.17,43.69 0 top
FID3  3.05,39.37 0 top
FID4  78.99,29.46 0 top
J1  23.88,2.54 0 top
JTAG1  6.6,49.53 180 top
Q1  53.09,39.37 0 top
Q2  57.66,39.37 0 top
Q3  62.23,39.37 0 top
R1  14.48,40.13 90 top
R2  11.94,40.13 90 top
R3  17.02,40.13 90 top
R4  19.56,40.13 90 top
R5  22.1,40.13 90 top
R6  33.78,40.13 90 top
R7  36.07,40.13 90 top
R8  38.35,40.13 90 top
R9  40.64,40.13 90 top
R10  54.36,35.81 90 top
R11  52.07,35.81 90 top
R12  58.93,35.81 90 top
R13  56.64,35.81 90 top
R14  63.5,35.81 90 top
R15  61.21,35.81 90 top
R16  21.59,45.97 180 top
R17  18.03,47.5 180 top
R20  7.37,40.13 90 top
R21  12.19,7.37 90 top
R22  76.2,9.14 180 top
R23  73.91,49.53 90 top
R24  76.2,49.53 90 top
R25  78.49,49.53 90 top
R26  80.77,49.53 90 top
R27  50.55,6.86 270 top
R28  0  [0603-RES]  39.62,6.86 90 top
R29  8.13,27.94 0 top
R30  8.13,30.48 180 top
R31  12.7,30.48 180 top
R32  0  [0603-RES]  36.83,6.86 90 top
R33  12.19,3.05 90 top
R34  79.76,9.14 180 top
R35  49.28,40.13 270 top
R36  56.64,43.43 180 top
R37  61.21,43.43 180 top
S1  5.33,4.32 0 top
S2  77.22,4.32 0 top
SJ1  12.7,30.23 0 bottom
SJ2  44.2,40.13 0 bottom
SJ3  44.2,37.08 0 bottom
SJ4  46.74,40.13 180 bottom
SJ5  46.74,37.08 180 bottom
SJ6  78.99,25.4 0 bottom
SJ7  78.99,22.1 0 bottom
SJ8  78.99,19.05 0 bottom
SJ9  78.99,16 0 bottom
SLIDER  53.34,5.08 0 top
U1  56.9,17.27 90 top
U2  0,0 0 top
U3  10.92,23.11 270 top
U$1  41.4,27.94 0 top
U$2  PA_LOGO_SYMLARGE  [PA_LOGO_AGENT_LRG_SYM]  28.7,26.42 0 top
U$3  28.7,26.42 0 bottom

### Tracks (layer width: path | path; a pad name or v marks a point on that pad's centre or on a via)
3V3
  Top 1.016: U2.3V3 38.1,3.3 36.83,4.57 R32.1
5V0
  Top 1.016: U2.5V0@0 40.64,3.56 39.62,4.57 R28.1
12V0  (via drill 0.36)
  Top 1.27: v48.26,4.83 48.26,7.11 48.77,7.62 50.46,7.62 R27.1
  Top 1.422: C13.1 4.21,20.8 U3.3 7.82,16 22.1,16 23.11,14.99 23.11,8.38 | 23.11,8.38 23.11,3.3 J1.1 | C9.1 23.29,8.56 23.11,8.38
  Bottom 1.422: v48.26,4.83 24.64,4.83 23.88,4.06 J1.1
!XRES  (via drill 0.36)
  Top 0.305: JTAG1.10 4.06,45.97 4.57,45.47 5.33,45.47 7.37,43.43 R20.2 7.28,40.89 6.6,40.89 6.1,40.39 6.1,36.58 7.37,35.31 v31.5,35.31 | U1.32 53.7,26.57 51.05,29.21 51.05,32 49.78,33.27 v31.5,33.27 | U2.RESET 35.56,3.05 34.04,4.57 32.26,4.57 31.5,5.33 v31.5,11.68
  Bottom 0.305: v31.5,11.68 v31.5,33.27 v31.5,35.31
A_B
  Top 0.305: 62.23,43.27 R37.1
  Top 0.61: Q3.3 62.23,43.27
A_BLUE
  Top 0.305: R37.2 60.36,43.52 | U$1.18
  Top 0.61: 60.36,43.52 58.67,45.21 53.34,45.21 52.58,44.45 U$1.18
A_G
  Top 0.305: 57.66,43.27 R36.1
  Top 0.61: Q2.3 57.66,43.27
A_GRN
  Top 0.305: U$1.17
  Top 0.61: U$1.17 51.31,41.91 54.52,41.91 R36.2
A_P  (via drill 0.36)
  Top 0.61: R35.2 49.28,35.31 v47.24,35.31
  Bottom 0.305: 47.24,37.03 SJ5.2
  Bottom 0.61: 47.24,37.03 v47.24,35.31 44.45,35.31 43.75,36.01 SJ3.2
A_R
  Top 0.61: Q1.3 50.72,40.47 50.04,41.15 49.44,41.15 R35.1
A_RED
  Bottom 0.61: SJ5.1 SJ4.1 46.29,42.22 U$1.16
C_B
  Top 0.305: 61.28,36.73 R15.2
  Top 0.61: Q3.1 61.28,36.73
C_G
  Top 0.305: 56.71,36.73 R13.2
  Top 0.61: Q2.1 56.71,36.73
C_R
  Top 0.203: 52.07,38.35 Q1.1
  Top 0.61: 52.07,38.35 R11.2
D0
  Top 0.305: U2.0 67.31,50.8 68.07,51.56 73.66,51.56 | 73.66,51.56 75.95,51.56 76.2,51.31 R24.2 | R23.2 73.91,51.31 73.66,51.56
D1
  Top 0.305: U2.1 65.02,52.32 78.49,52.32 | 78.49,52.32 80.26,52.32 80.77,51.82 R26.2 | R25.2 78.49,52.32
DB4
  Top 0.203: 33.78,41.15 R6.2 | U$1.11
  Top 0.305: 33.78,41.15 34.8,42.16 U$1.11
DB5
  Top 0.203: 36.07,41.15 R7.2 | U$1.12
  Top 0.305: 36.07,41.15 37.34,42.42 U$1.12
DB6
  Top 0.203: 38.35,41.15 R8.2 | U$1.13
  Top 0.305: 38.35,41.15 39.88,42.67 U$1.13
DB7
  Top 0.203: 40.64,41.15 R9.2 | U$1.14
  Top 0.305: 40.64,41.15 42.42,42.93 U$1.14
E
  Top 0.305: R5.2 U$1.6
GND  (via drill 0.36)
  Top 0.203: 4.06,51.31 JTAG1.9
  Top 0.305: 52.95,19.67 53.09,19.81 | R1.1 14.48,38.35 14.22,38.1 9.65,38.1 9.4,38.35 U$1.1 11.18,45.21 11.18,46.74 11.94,47.5 C1.2 | JTAG1.9 4.14,51.31 5.26,51.31 JTAG1.7 JTAG1.5 JTAG1.3 | 48.43,23.11 C6.2
  Top 0.61: 51.14,23.03 53.09,21.08 53.09,20.07 | U1.36 52.95,19.67 | 53.09,19.81 53.09,20.07 | 52.32,10.41 52.83,10.41 52.9,10.48 U1.1 52.9,13.72 | 52.9,13.72 52.9,19.88 53.09,20.07 | 52.9,13.72 53.15,13.46 59.44,13.46 60.1,12.8 U1.10 60.1,11.02 | C2.2 C3.2 C12.2 C14.2 | C5.2 C4.2 43.78,24.89 v42.16,24.89 | C6.2 C7.2 | R31.1 v14.99,30.48
  Top 1.422: U2.GND@0 U2.GND@1 45.72,8.31 C8.2 47.83,10.41 52.32,10.41 | C10.2 v18.03,29.46 21.08,29.46 C11.2 | C9.2 26.49,2.62 J1.2
  Bottom 0.203: SJ2.2 42.93,40.13 42.93,35.81 44.2,34.54 48.01,34.54 48.01,37.85 47.75,38.1 47.24,38.1 47.24,40.13 SJ4.2
  Bottom 0.305: SJ6.1 SJ7.1 SJ8.1 SJ9.1
  Bottom 0.61: v14.99,30.48 13.4,30.48 SJ1.1
  Bottom 1.422: v18.03,29.46 18.03,30.48 v14.99,30.48
  pour Top (isolate 0.305, hatched): 1.02,0 0,1.02 0,52.32 1.02,53.34 81.53,53.34 82.55,52.32 82.55,1.02 81.53,0
  pour Bottom (isolate 0.305, hatched): 1.02,0 0,1.02 0,52.32 1.02,53.34 81.53,53.34 82.55,52.32 82.55,1.27 82.55,1.02 81.53,0
K
  Bottom 0.61: SJ3.1 SJ2.1 44.65,43.12 U$1.15
P0_0  (via drill 0.36)
  Top 0.305: U1.24 60.1,25.55 v60.71,26.16 | v48.77,26.16 v41.66,26.16
  Bottom 0.305: v60.71,26.16 v48.77,26.16 | U2.10 39.12,48.26 41.15,46.23 42.16,46.23 43.69,44.45 43.69,42.67 41.66,40.64 v41.66,26.16
P0_1  (via drill 0.36)
  Top 0.305: v48.77,28.7 v39.37,28.7 | U1.25 59.3,26.28 60.96,27.94 v60.96,28.7
  Bottom 0.305: v60.96,28.7 v48.77,28.7 | v39.37,28.7 39.37,40.89 41.15,42.67 41.15,44.96 38.86,47.24 37.34,47.24 36.58,48.01 U2.11
P0_2  (via drill 0.36)
  Top 0.305: U1.26 58.5,27.25 v58.93,27.69 | v50.04,27.69 v37.34,27.69
  Bottom 0.305: U2.12 34.04,46.99 34.54,46.48 37.34,46.48 38.61,45.21 38.61,42.67 37.34,41.4 v37.34,27.69 | v58.93,27.69 v50.04,27.69
P0_3  (via drill 0.36)
  Top 0.305: U1.27 57.7,29.76 v57.91,29.72 | v50.04,29.72 50.04,31.75 49.28,32.26 v34.8,32.26
  Bottom 0.305: v57.91,29.72 v50.04,29.72 | v34.8,32.26 34.8,41.4 36.07,42.67 36.07,44.45 35.05,45.47 34.04,45.47 31.5,48.01 U2.13
P0_4  (via drill 0.36)
  Top 0.305: R25.1 v78.49,47.24 | v73.91,47.24 R23.1 | U1.28 56.9,30.23 57.4,30.73 65.28,30.73 v66.55,32
  Bottom 0.305: v78.49,47.24 v73.91,47.24 67.31,47.24 66.55,46.48 v66.55,32
P0_5  (via drill 0.36)
  Top 0.305: R26.1 80.77,46.23 v76.2,46.23 | v76.2,46.23 R24.1 | U1.29 56.1,30.7 56.9,31.5 64.77,31.5 65.53,32.26 65.53,45.72 66.04,46.23 v76.2,46.23
P0_6  (via drill 0.36)
  Top 0.305: v56.64,33.53 R13.1 | U1.30 55.3,27.51 53.09,29.72 v53.09,33.53
  Bottom 0.305: v56.64,33.53 53.34,33.53 53.09,33.27 v53.09,33.53
P0_7
  Top 0.305: U1.31 54.5,26.78 52.07,29.21 R11.1
P1_0  (via drill 0.36)
  Top 0.305: R6.1 v33.78,37.85 | U1.37 37.26,18.87 36.83,19.3 34.04,19.3 v33.78,19.05
  Bottom 0.305: v33.78,37.85 v33.78,19.05
P1_1  (via drill 0.36)
  Top 0.305: R7.1 v36.07,37.85 | U1.38 51.06,18.03 39.37,18.03 39.12,18.29 v36.07,18.29
  Bottom 0.305: v36.07,37.85 v36.07,18.29
P1_2  (via drill 0.36)
  Top 0.305: R8.1 v38.35,37.85 | v38.35,17.27 U1.39
  Bottom 0.305: v38.35,37.85 v38.35,17.27
P1_3  (via drill 0.36)
  Top 0.305: R9.1 v40.64,37.85 | U1.40 40.86,16.47 v40.64,16.26
  Bottom 0.305: v40.64,37.85 v40.64,16.26
P1_4  (via drill 0.36)
  Top 0.305: U1.41 41.58,15.67 41.15,15.24 27.94,15.24 v27.43,15.75 | R5.1 26.5,39.28 27.43,38.35 v27.43,37.59
  Bottom 0.305: v27.43,15.75 v27.43,37.59
P1_5  (via drill 0.36)
  Top 0.305: U1.42 41.8,14.87 41.4,14.48 26.92,14.48 26.16,15.24 v24.89,15.24 | v24.89,36.32 19.98,36.32 R3.1
  Bottom 0.305: v24.89,15.24 v24.89,36.32
P1_6  (via drill 0.36)
  Top 0.305: v26.16,13.72 41.66,13.72 42.01,14.07 U1.43 | v26.16,37.34 20.57,37.34 19.56,38.35 R4.1
  Bottom 0.305: v26.16,13.72 v26.16,37.34
P1_7  (via drill 0.36)
  Top 0.305: U1.44 47.05,13.27 44.45,10.67 v34.8,10.67 | v48.77,30.73 v34.8,30.73 | v61.21,33.53 R15.1
  Bottom 0.305: v34.8,30.73 v34.8,10.67 | v48.77,30.73 61.21,30.73 v61.21,33.53
P2_0
  Top 0.305: U1.2 53.7,5.44 SLIDER.1
P2_1
  Top 0.305: U1.3 54.5,6.46 SLIDER.2
P2_2
  Top 0.305: U1.4 55.3,7.44 56.13,6.6 57.91,6.6 58.42,6.1 SLIDER.3
P2_3
  Top 0.305: U1.5 56.1,7.91 56.9,7.11 60.2,7.11 60.96,6.35 SLIDER.4
P2_4
  Top 0.305: U1.6 56.9,8.38 57.4,7.87 60.96,7.87 62.48,6.35 63.25,6.35 63.5,6.1 SLIDER.5
P2_5
  Top 0.305: U1.7 57.7,9.11 58.17,8.64 61.47,8.64 62.99,7.11 64.01,7.11 SLIDER.6
P2_6
  Top 0.305: U1.8 58.5,9.58 58.67,9.4 61.98,9.4 63.5,7.87 65.28,7.87 67.31,5.84 67.82,5.84 SLIDER.7
P2_7
  Top 0.305: U1.9 59.3,10.3 59.44,10.16 64.01,10.16 64.26,9.91 69.85,9.91 71.12,8.64 SLIDER.8
P3_0  (via drill 0.36)
  Top 0.203: 60.96,11.43 U1.11
  Top 0.305: S1.1 2.08,6.55 3.56,5.08 10.76,5.08 R21.1 14.64,6.52 v14.99,7.37 | 60.96,11.43 61.98,11.43 62.48,10.92 v65.28,10.92
  Bottom 0.305: v14.99,7.37 64.52,7.37 65.28,8.13 v65.28,10.92
P3_1
  Top 0.305: 76.71,8.8 R22.1 | S2.1 75.16,6.58 76.96,8.38 76.96,9.06 R22.1 | U1.12 74.61,13.27 76.96,10.92 76.96,9.23 R22.1
P3_2  (via drill 0.36)
  Top 0.305: JTAG1.2 v9.14,45.21 | U1.13 60.45,14.07 v60.45,13.97 | v42.67,11.68 v32.77,11.68 | v32.77,34.29 v7.62,34.29
  Bottom 0.305: v9.14,45.21 7.62,43.69 v7.62,34.29 | v60.45,13.97 45.21,13.97 v42.67,11.68 | v32.77,11.68 v32.77,34.29
P3_3  (via drill 0.36)
  Top 0.305: JTAG1.4 7.87,45.72 v7.37,45.21 | U1.14 61.07,14.87 v60.2,15.75 | v40.89,12.7 v29.46,12.7 | v29.46,33.27 6.86,33.27 v5.84,34.29
  Bottom 0.305: v7.37,45.21 5.84,43.69 v5.84,34.29 | v60.2,15.75 43.94,15.75 v40.89,12.7 | v29.46,12.7 v29.46,33.27
P3_4  (via drill 0.36)
  Top 0.305: U1.15 75.87,15.67 v76.2,16
  Bottom 0.305: v76.2,16 SJ9.2
P3_5  (via drill 0.36)
  Top 0.305: U1.16 72.61,16.47 75.18,19.05 v76.2,19.05
  Bottom 0.305: v76.2,19.05 SJ8.2
P3_6  (via drill 0.36)
  Top 0.305: U1.17 71.37,17.27 72.9,18.8 72.9,21.34 73.66,22.1 v76.2,22.1
  Bottom 0.305: v76.2,22.1 SJ7.2
P3_7  (via drill 0.36)
  Top 0.305: U1.18 70.4,18.07 71.37,19.05 71.37,24.64 72.14,25.4 v76.2,25.4
  Bottom 0.305: v76.2,25.4 SJ6.2
P4_0  (via drill 0.36)
  Top 0.305: v28.45,20.07 32.77,20.07 33.02,20.32 42.67,20.32 v43.18,19.81 | v58.42,19.56 59.69,19.56 59.8,19.67 U1.20 | R17.1 19.81,47.5 21.34,49.02 U2.SCL
  Bottom 0.305: v43.18,19.81 58.17,19.81 v58.42,19.56 | v28.45,20.07 28.45,45.21 26.67,46.99 23.37,46.99 21.34,49.02 U2.SCL
P4_1  (via drill 0.36)
  Top 0.305: U1.21 60.3,20.47 v59.94,20.83 | v44.45,21.08 v30.48,21.08 | R16.1 23.11,45.97 23.88,46.74 U2.SDA
  Bottom 0.305: v59.94,20.83 44.7,20.83 v44.45,21.08 | v30.48,21.08 30.48,41.66 30.99,42.16 30.99,46.48 29.21,48.26 24.64,48.26 23.88,49.02 U2.SDA
P4_2
  Top 0.305: U1.22 63.44,21.27 63.75,21.59 63.75,22.44 C14.1
P4_3
  Top 0.305: U1.23 61.43,23.07 63.5,25.15 67.31,25.15 67.82,24.64 C12.1
P_B
  Top 0.305: 63.18,36.98 R14.2
  Top 0.61: Q3.2 63.18,36.98
P_G
  Top 0.305: 58.61,36.98 R12.2
  Top 0.61: Q2.2 58.61,36.98
P_R
  Top 0.203: 54.36,38.1 54.1,38.35 Q1.2
  Top 0.61: 54.36,38.1 R10.2
RS
  Top 0.305: R3.2 U$1.4
RW
  Top 0.305: R4.2 U$1.5
S1_R
  Top 0.305: S1.3 3.07,2.06 4.83,3.81 12.1,3.81 R33.2
S2_R
  Top 0.305: S2.3 75.21,2.06 78.74,5.59 78.74,8.98 R34.2
V3_5  (via drill 0.36)
  Top 0.61: 8.89,30.48 R30.1 v10.41,30.48 R31.2
  Bottom 0.61: v10.41,30.48 12,30.48 SJ1.2
VADJ
  Top 0.61: U3.1 7.28,25.97 R29.1 R30.2
VBIAS
  Top 0.305: U$1.3 R1.2 13.55,40.98 13.21,40.64 13.21,39.62 12.95,39.37 12.03,39.37 R2.1
VCCD
  Top 0.203: U1.33 52.83,23.11 52.85,23.11
  Top 0.305: 52.85,23.03 52.85,23.11 52.85,24.11 52.32,24.64 50.89,24.64 C7.1
  Top 0.61: C6.1 C7.1
VDD  (via drill 0.36)
  Top 0.203: C11.1 21.08,24.38 | U1.34 51.31,21.34 51.03,21.34
  Top 0.305: R2.2 U$1.2 12.45,43.44 14.73,45.72 14.73,47.41 C1.1 | JTAG1.1 13.64,51.38 14.99,50.04 14.99,47.66 C1.1 | R20.1 7.37,36.32 v11.94,36.32 | v63.37,11.94 73.91,11.94 75.18,10.67 75.18,9.31 R22.2 | C1.1 R17.2 18.71,45.97 R16.2
  Top 0.406: U1.35 50.39,20.47 49.53,21.34
  Top 0.61: R14.1 63.37,34.96 v63.37,32.64 63.37,32.51 58.93,32.51 | R10.1 54.36,32.51 58.93,32.51 | R12.1 58.93,32.51 | v42.16,23.11 42.25,23.03 C4.1 C5.1 46.23,21.34 49.53,21.34 51.03,21.34 | U1.19 67.64,18.87 67.82,19.05 C3.1 C2.1 69.25,19.22 v69.6,19.3 | R29.2 10.92,27.94 v10.92,23.11
  Top 1.422: C8.1 42.6,8.89 v41.4,8.89 39.62,8.89 | R32.2 36.83,8.89 39.62,8.89 | R28.2 39.62,8.89 | U3.2 v10.92,23.11 | C10.1 v18.03,23.11 | 21.08,24.38 v21.08,23.11 | v13.97,8.89 12.19,8.89 R21.2
  Bottom 0.305: U$1.2
  Bottom 0.61: v69.6,19.3 63.37,19.3
  Bottom 1.422: U$1.2 v11.94,36.32 23.11,36.32 23.11,23.11 | 23.11,8.89 v41.4,8.89 63.37,8.89 v63.37,11.94 63.37,19.3 63.37,22.86 | 63.37,22.86 v63.37,32.64 | v42.16,23.11 63.12,23.11 63.37,22.86 | 23.11,23.11 23.11,8.89 | v10.92,23.11 v18.03,23.11 v21.08,23.11 23.11,23.11 | 23.11,8.89 v13.97,8.89
VIN
  Top 1.27: U2.VIN 49.78,2.54 50.55,3.3 R27.2

### Text on the board
tPlace: PatternAgents.com | PatternAgents | Videre Shield | Rev. 1.3.1 | PCA#366A2013 | 12V | GND
bPlace: PatternAgents.com | PatternAgents | Videre Shield | Rev. 1.3.1 | PCA#366A2013